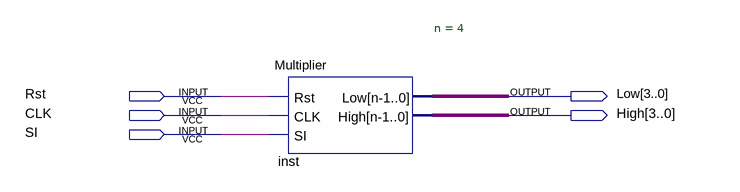
[diagram p0: schematic sheet]
// Quartus schematic multiplier-schematic.bdf as structural Verilog: 1 symbols, 5 pins
module \multiplier-schematic  (
  input  Rst,
  input  CLK,
  input  SI,
  output [3:0] Low,
  output [3:0] High
);

  Multiplier #(.n(4)) inst (.Rst(Rst), .CLK(CLK), .SI(SI), .Low(Low), .High(High));
endmodule
